# EAGLE design Battery board V4.0 (EAGLE 7.6.0)
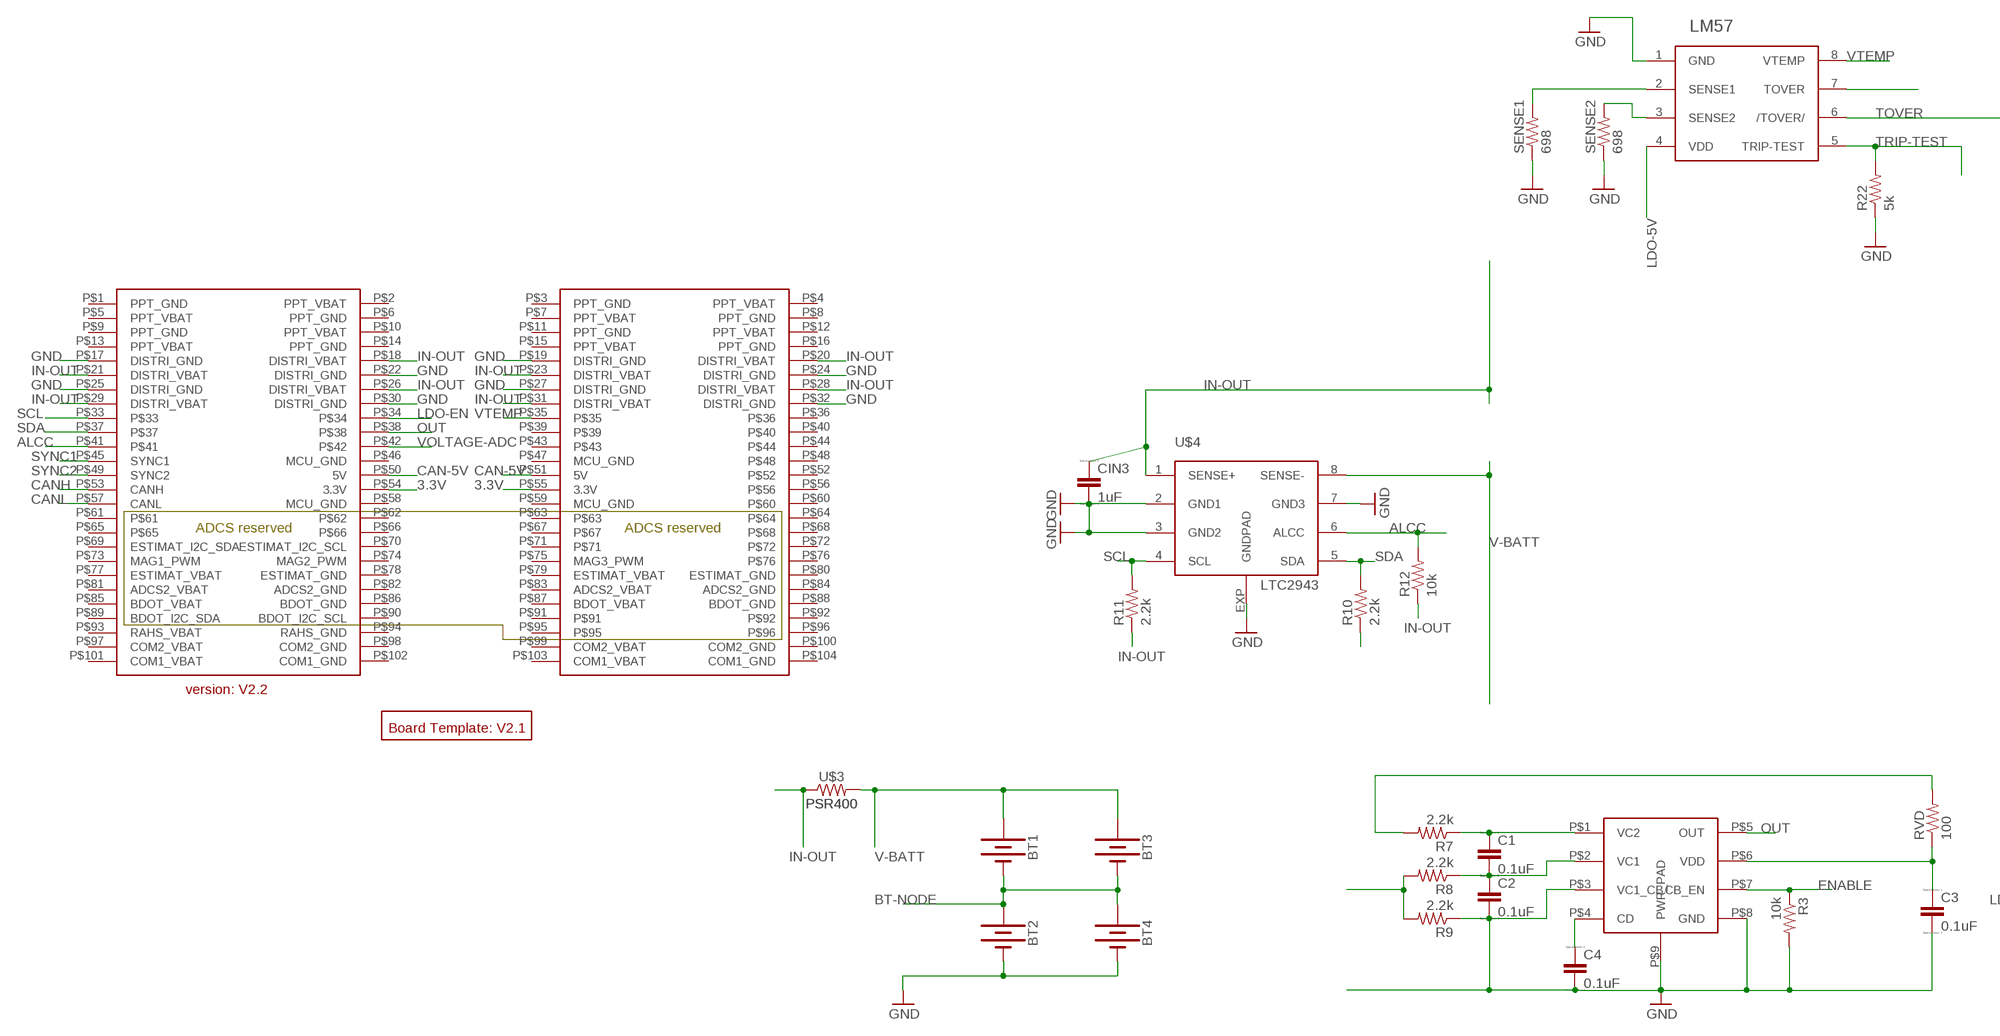
[diagram p0: schematic, sheet 1, part 1 of 2]
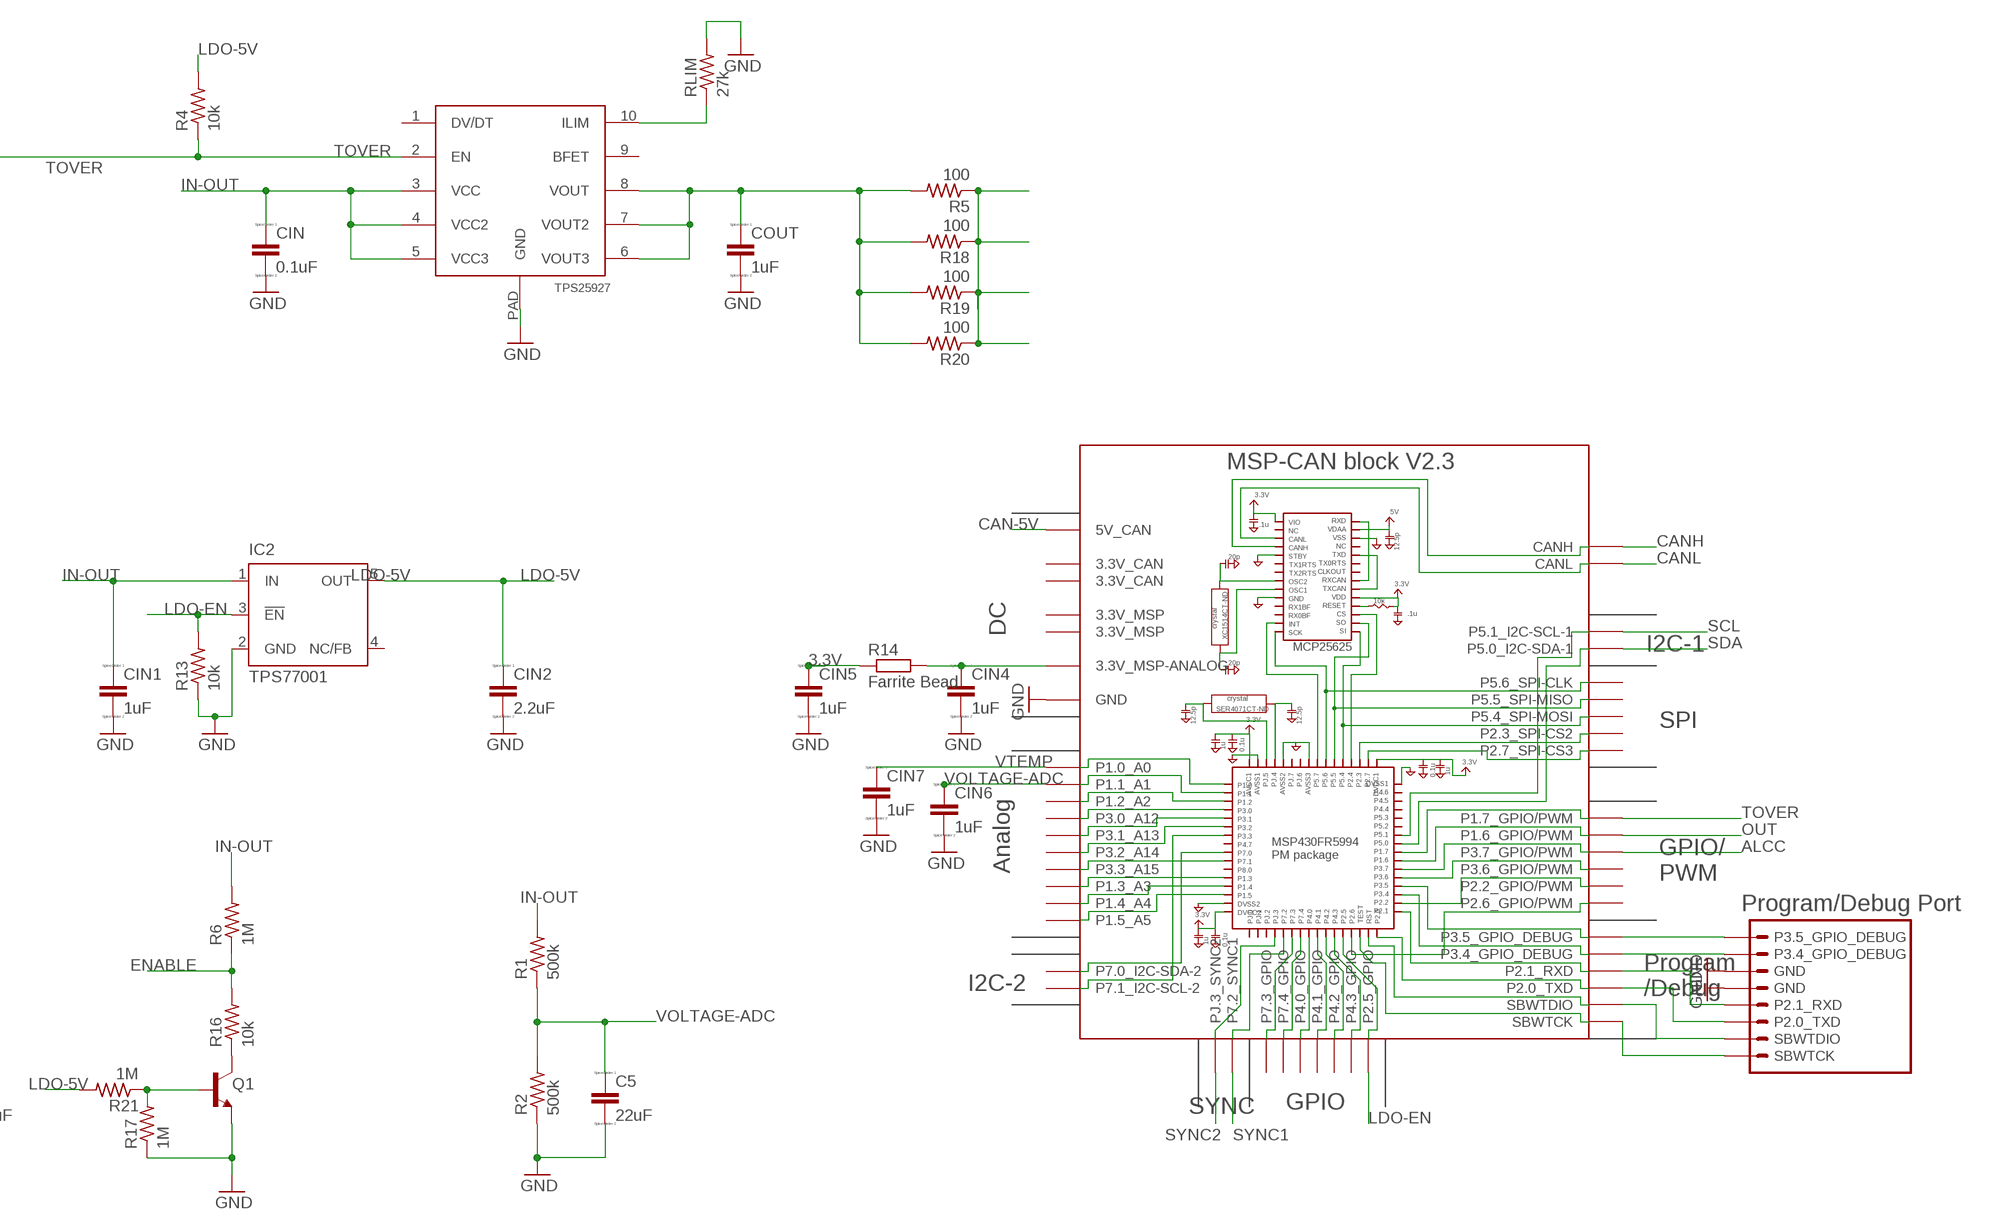
[diagram p1: schematic, sheet 1, part 2 of 2]

## Parts
BT1  BATTERY-18650  [BATTERY_18650-HOLDER]
BT2  BATTERY-18650  [BATTERY_18650-HOLDER]
BT3  BATTERY-18650  [BATTERY_18650-HOLDER]
BT4  BATTERY-18650  [BATTERY_18650-HOLDER]
C1  0.1uF  C  [C0805]
C2  0.1uF  C  [C0805]
C3  0.1uF  C  [C0805]
C4  0.1uF  C  [C0805]
C5  22uF  CC1206  [C1206]
CIN  0.1uF  C  [C0805]
CIN1  1uF  C  [C0805]
CIN2  2.2uF  C  [C0805]
CIN3  1uF  C  [C0805]
CIN4  1uF  C  [C0805]
CIN5  1uF  C  [C0805]
CIN6  1uF  C  [C0805]
CIN7  1uF  C  [C0805]
COUT  1uF  C  [C0805]
IC2  TPS77001  [SOT23-DBV]
Q1  TRANS_NPN-MMBT2222AL  [SOT23-3]
R1  500k  R-US_R0805  [R0805]
R2  500k  R-US_R0805  [R0805]
R3  10k  R-US_R0805  [R0805]
R4  10k  R-US_R0805  [R0805]
R5  100  R-US_R0805  [R0805]
R6  1M  R-US_R0805  [R0805]
R7  2.2k  R-US_R0805  [R0805]
R8  2.2k  R-US_R0805  [R0805]
R9  2.2k  R-US_R0805  [R0805]
R10  2.2k  R-US_R0805  [R0805]
R11  2.2k  R-US_R0805  [R0805]
R12  10k  R-US_R0805  [R0805]
R13  10k  R-US_R0805  [R0805]
R14  Farrite Bead  R-EU_R1206  [R1206]
R16  10k  R-US_R0805  [R0805]
R17  1M  R-US_M0805  [M0805]
R18  100  R-US_R0805  [R0805]
R19  100  R-US_R0805  [R0805]
R20  100  R-US_R0805  [R0805]
R21  1M  R-US_M0805  [M0805]
R22  5k  R-US_R0805  [R0805]
RLIM  27k  R-US_R0805  [R0805]
RVD  100  R-US_R0805  [R0805]
SENSE1  698  R-US_R0805  [R0805]
SENSE2  698  R-US_R0805  [R0805]
U$1  MSP-CAN_BLOCK  [MSP-CAN_BLOCK]
U$2  PROGRAM/DEBUG_PORT  [1X08_CONNECTOR]
U$3  PSR400  [PSR400]
U$4  LTC2943  [DFN8(3X3)LT]
U$5  TPS252927  [VSON10]
U$6  LM57  [TSSOP-8]
U$7  2X26_CONNECTOR_(V2.2)  [4X26_CONNECTOR_(V2.2)]
U$8  BQ29209  [VSON8]
U$9  BOARD_TEMPLATE_(V2.1)  [BOARD_TEMPLATE_(V2.1)]

## Nets
3.3V: CIN5.1 R14.1 U$7.P$54(3.3V) U$7.P$55(3.3V)
ALCC: R12.2 U$1.P3.7_GPIO/PWM U$4.6(ALCC) U$7.P$41
BASE: Q1.1(B) R17.2 R21.1
BT-NODE: BT1.GND@1(-) BT2.PWR@1(+) BT3.GND@1(-) BT4.PWR@1(+) R8.2 R9.2
CAN-5V: U$1.5V(5V_CAN) U$7.P$50(5V) U$7.P$51(5V)
CANH: U$1.CANH U$7.P$53(CANH)
CANL: U$1.CANL U$7.P$57(CANL)
ENABLE: R3.1 R6.1 R16.2 U$8.P$7(CB_EN)
FERRITE-BEAD: CIN4.1 R14.2 U$1.3.3V_ANALOG@MSP2(3.3V_MSP-ANALOG)
GND: BT2.GND@1(-) BT4.GND@1(-) C2.2 C3.2 C4.2 C5.2 CIN1.2 CIN2.2 CIN3.2 CIN4.2 CIN5.2 CIN6.2 CIN7.2 CIN.2 COUT.2 IC2.2(GND) Q1.2(E) R2.1 R3.2 R9.1 R13.1 R17.1 R22.1 RLIM.2 SENSE1.1 SENSE2.1 U$1.GND@1(GND) U$1.GND@2(GND) U$1.GND@3(GND) U$1.GND@4(GND) U$1.GND@5(GND) U$1.GND@7(GND) U$1.GND@8(GND) U$1.GND@9(GND) U$1.GND@10(GND) U$1.GND@11(GND) U$1.GND@12(GND) U$1.GND@13(GND) U$1.GND@14(GND) U$1.GND@15(GND) U$1.GND@16(GND) U$1.GND@17(GND) U$1.GND@26(GND) U$2.5(GND) U$2.6(GND) U$4.2(GND1) U$4.3(GND2) U$4.7(GND3) U$4.EXP(GNDPAD) U$5.PAD(GND) U$6.1(GND) U$7.P$17(DISTRI_GND) U$7.P$19(DISTRI_GND) U$7.P$22(DISTRI_GND) U$7.P$24(DISTRI_GND) U$7.P$25(DISTRI_GND) U$7.P$27(DISTRI_GND) U$7.P$30(DISTRI_GND) U$7.P$32(DISTRI_GND) U$8.P$3(VC1_CB) U$8.P$8(GND) U$8.P$9(PWR_PAD)
HEATER1: R5.1 R18.1 R19.1 R20.1
IN-OUT: CIN1.1 CIN3.1 CIN.1 IC2.1(IN) R1.2 R6.2 R10.1 R11.1 R12.1 U$3.P$1 U$4.1(SENSE+) U$5.3(VCC) U$5.4(VCC2) U$5.5(VCC3) U$7.P$18(DISTRI_VBAT) U$7.P$20(DISTRI_VBAT) U$7.P$21(DISTRI_VBAT) U$7.P$23(DISTRI_VBAT) U$7.P$26(DISTRI_VBAT) U$7.P$28(DISTRI_VBAT) U$7.P$29(DISTRI_VBAT) U$7.P$31(DISTRI_VBAT)
LDO-5V: CIN2.1 IC2.5(OUT) R4.2 R21.2 U$6.4(VDD)
LDO-EN: IC2.3(!EN) R13.2 U$1.P2.5_GPIO U$7.P$34
N$4: C1.1 R7.1 U$8.P$1(VC2)
N$5: C1.2 C2.1 R8.1 U$8.P$2(VC1)
N$6: C3.1 RVD.1 U$8.P$6(VDD)
N$7: Q1.3(C) R16.1
N$8: C4.1 U$8.P$4(CD)
N$9: COUT.1 R5.2 R18.2 R19.2 R20.2 U$5.6(VOUT3) U$5.7(VOUT2) U$5.8(VOUT)
N$10: RLIM.1 U$5.10(ILIM)
N$11: SENSE1.2 U$6.2(SENSE1)
N$12: SENSE2.2 U$6.3(SENSE2)
N$13: U$6.7(TOVER)
N$14: U$1.P3.5_GPIO_DEBUG U$2.8(P3.5_GPIO_DEBUG)
N$15: U$1.P3.4_GPIO_DEBUG U$2.7(P3.4_GPIO_DEBUG)
N$19: U$1.P2.1_RXD U$2.4(P2.1_RXD)
N$20: U$1.P2.0_TXD U$2.3(P2.0_TXD)
N$21: U$1.SBWTDIO U$2.2(SBWTDIO)
N$22: U$1.SBWTCK U$2.SBWTCK
OUT: U$1.P1.6_GPIO/PWM U$7.P$38 U$8.P$5(OUT)
SCL: R11.2 U$1.P5.1_I2C-SCL-1 U$4.4(SCL) U$7.P$33
SDA: R10.2 U$1.P5.0_I2C-SDA-1 U$4.5(SDA) U$7.P$37
SYNC1: U$1.P7.2_SYNC1 U$7.P$45(SYNC1)
SYNC2: U$1.PJ.3_SYNC2 U$7.P$49(SYNC2)
TOVER: R4.1 U$1.P1.7_GPIO/PWM U$5.2(EN) U$6.6(/TOVER/)
TRIP-TEST: R22.2 U$6.5(TRIP-TEST)
V-BATT: BT1.PWR@1(+) BT3.PWR@1(+) R7.2 RVD.2 U$3.P$2 U$4.8(SENSE-)
VOLTAGE-ADC: C5.1 CIN6.1 R1.1 R2.2 U$1.P1.1_A1 U$7.P$42
VTEMP: CIN7.1 U$1.P1.0_A0 U$6.8(VTEMP) U$7.P$35
Unconnected: IC2.4(NC/FB) U$1.3.3V@CAN1(3.3V_CAN) U$1.3.3V@CAN2(3.3V_CAN) U$1.3.3V@MSP1(3.3V_MSP) U$1.3.3V@MSP2(3.3V_MSP) U$1.P1.2_A2 U$1.P1.3_A3 U$1.P1.4_A4 U$1.P1.5_A5 U$1.P2.2_GPIO/PWM U$1.P2.4_SPI-CS2(P2.3_SPI-CS2) U$1.P2.6_GPIO/PWM U$1.P2.7_SPI-CS3 U$1.P3.0_A12 U$1.P3.1_A13 U$1.P3.2_A14 U$1.P3.3_A15 U$1.P3.6_GPIO/PWM U$1.P4.0_GPIO U$1.P4.1_GPIO U$1.P4.2_GPIO U$1.P4.3_GPIO U$1.P5.4_SPI-MOSI U$1.P5.5_SPI-MISO U$1.P5.6_SPI-CLK U$1.P7.0_I2C-SDA-2 U$1.P7.1_I2C-SCL-2 U$1.P7.3_GPIO U$1.P7.4_GPIO U$5.1(DV/DT) U$5.9(BFET) U$7.P$1(PPT_GND) U$7.P$2(PPT_VBAT) U$7.P$3(PPT_GND) U$7.P$4(PPT_VBAT) U$7.P$5(PPT_VBAT) U$7.P$6(PPT_GND) U$7.P$7(PPT_VBAT) U$7.P$8(PPT_GND) U$7.P$9(PPT_GND) U$7.P$10(PPT_VBAT) U$7.P$11(PPT_GND) U$7.P$12(PPT_VBAT) U$7.P$13(PPT_VBAT) U$7.P$14(PPT_GND) U$7.P$15(PPT_VBAT) U$7.P$16(PPT_GND) U$7.P$36 U$7.P$39 U$7.P$40 U$7.P$43 U$7.P$44 U$7.P$46(MCU_GND) U$7.P$47(MCU_GND) U$7.P$48 U$7.P$52 U$7.P$56 U$7.P$58(MCU_GND) U$7.P$59(MCU_GND) U$7.P$60 U$7.P$61 U$7.P$62 U$7.P$63 U$7.P$64 U$7.P$65 U$7.P$66 U$7.P$67 U$7.P$68 U$7.P$69(ESTIMAT_I2C_SDA) U$7.P$70(ESTIMAT_I2C_SCL) U$7.P$71 U$7.P$72 U$7.P$73(MAG1_PWM) U$7.P$74(MAG2_PWM) U$7.P$75(MAG3_PWM) U$7.P$76 U$7.P$77(ESTIMAT_VBAT) U$7.P$78(ESTIMAT_GND) U$7.P$79(ESTIMAT_VBAT) U$7.P$80(ESTIMAT_GND) U$7.P$81(ADCS2_VBAT) U$7.P$82(ADCS2_GND) U$7.P$83(ADCS2_VBAT) U$7.P$84(ADCS2_GND) U$7.P$85(BDOT_VBAT) U$7.P$86(BDOT_GND) U$7.P$87(BDOT_VBAT) U$7.P$88(BDOT_GND) U$7.P$89(BDOT_I2C_SDA) U$7.P$90(BDOT_I2C_SCL) U$7.P$91 U$7.P$92 U$7.P$93(RAHS_VBAT) U$7.P$94(RAHS_GND) U$7.P$95 U$7.P$96 U$7.P$97(COM2_VBAT) U$7.P$98(COM2_GND) U$7.P$99(COM2_VBAT) U$7.P$100(COM2_GND) U$7.P$101(COM1_VBAT) U$7.P$102(COM1_GND) U$7.P$103(COM1_VBAT) U$7.P$104(COM1_GND)

## Library data of the parts
BT1-BT4 = SparkFun-Batteries:BATTERY: Battery - Single Cell A variety of battery chemistries, sizes, and footprints. Device List: 20MM_PTH - Coin Cell Battery Holder - 20mm (PTH) <https://www.sparkfun.com/products/783> 12MM_SMD - Coin Cell Battery Holder - 12mm (SMD) <https://www.sparkfun.com/products/10592> 12MM_PTH - Coin Cell Battery Holder - 12mm (PTH) <https://www.sparkfun.com/products/7948> 20MM_SMD - 20mm Coin Cell Battery Holder (SMD) (2 legs) Used on the Big Time Watch Kit <https://www.sparkfun.com/products/11734> 20MM_SMD_4LEGS - Coin Cell Battery Holder - 20mm (SMD) <https://www.sparkfun.com/products/11892> 20MM_SMD_4LEGS_OVERPASTE - Coin Cell Battery Holder - 20mm (SMD) <https://www.sparkfun.com/products/11892> (Over-paste on the legs) 24.5MM_PTH - Coin Cell Battery Holder - 24.5mm (PTH) <https://www.sparkfun.com/products/8863> 9V - 9V Battery Holder - PC Mount Used on the SparkFun SparkPunk Sound Kit <https://www.sparkfun.com/products/11177> and SparkFun SparkPunk Sequencer Kit <https://www.sparkfun.com/products/12707> 18650 - Battery Holder - 18650 (PTH) <https://www.sparkfun.com/products/13113> AA - Battery Holder - 1xAA (PTH) <https://www.sparkfun.com/products/7949> AAA - Battery Holder - 1xAAA (PTH) <https://www.sparkfun.com/products/12718> AA_KIT - Battery Holder - 1xAA (PTH) <https://www.sparkfun.com/products/7949> Special kit package - pads only have exposed copper on one side of the board. AAA_KIT - Battery Holder - 1xAAA (PTH) <https://www.sparkfun.com/products/12718> Special kit package - pads only have exposed copper on one side of the board.; PROD_ID: BATT-12327; SF_SKU: PRT-13113
C1-C5 CIN CIN1-CIN7 COUT = eagle-ltspice:C: CAPACITOR, European symbol; SPICEMODEL: NONE; SPICEPREFIX: C
IC2 = texas:TPS770*: ULTRALOW-POWER 50-mA LOW-DROPOUT LINEAR REGULATORS 50-mA Low-Dropout Regulator Source: http://focus.ti.com/lit/ds/symlink/tps77001.pdf; MF: TEXAS INSTRUMENTS; MPN: TPS77001DBVT; OC_FARNELL: 8461554; OC_NEWARK: 77C1171
Q1 = SparkFun-DiscreteSemi:TRANS_NPN: NPN transistor Current controlled devices typically used to amplify current or used as a switch. BC547 - COM-08928 <http://www.sparkfun.com/products/8928> (TO-92 45V 100mA) (1.Collector 2.Base 3.Emitter) 2N3904 - COM-00521 <http://www.sparkfun.com/products/521> (TO-92 40V 200mA) (1.Emitter 2.Base 3.Collector) P2N2222A - COM-12852 <http://www.sparkfun.com/products/12852> (TO-92 40V 600mA) (1.Collector 2.Base 3.Emitter); PROD_ID: TRANS-08049; VALUE: 600mA/40V
R1-R13 R16-R22 RLIM RVD SENSE1 SENSE2 = rcl:R-US_: RESISTOR, American symbol
R14 = rcl:R-EU_: RESISTOR, European symbol
U$1 = CubeSat(V2.2) (2):MSP-CAN_BLOCK
U$2 = CubeSat(V2.2) (2):PROGRAM/DEBUG_PORT
U$3 = Parts for Power Team1:PSR400
U$4 = Parts for Power Team1:LTC2943
U$5 = Parts for Power Team1:TPS252927: http://www.ti.com/product/tps25927/datasheet
U$6 = Parts for Power Team:LM57
U$7 = CubeSat(V2.2) (2):2X26_CONNECTOR_(V2.2)
U$8 = Parts for Power Team1:BQ29209
U$9 = CubeSat(V2.2) (2):BOARD_TEMPLATE_(V2.1)

## Board
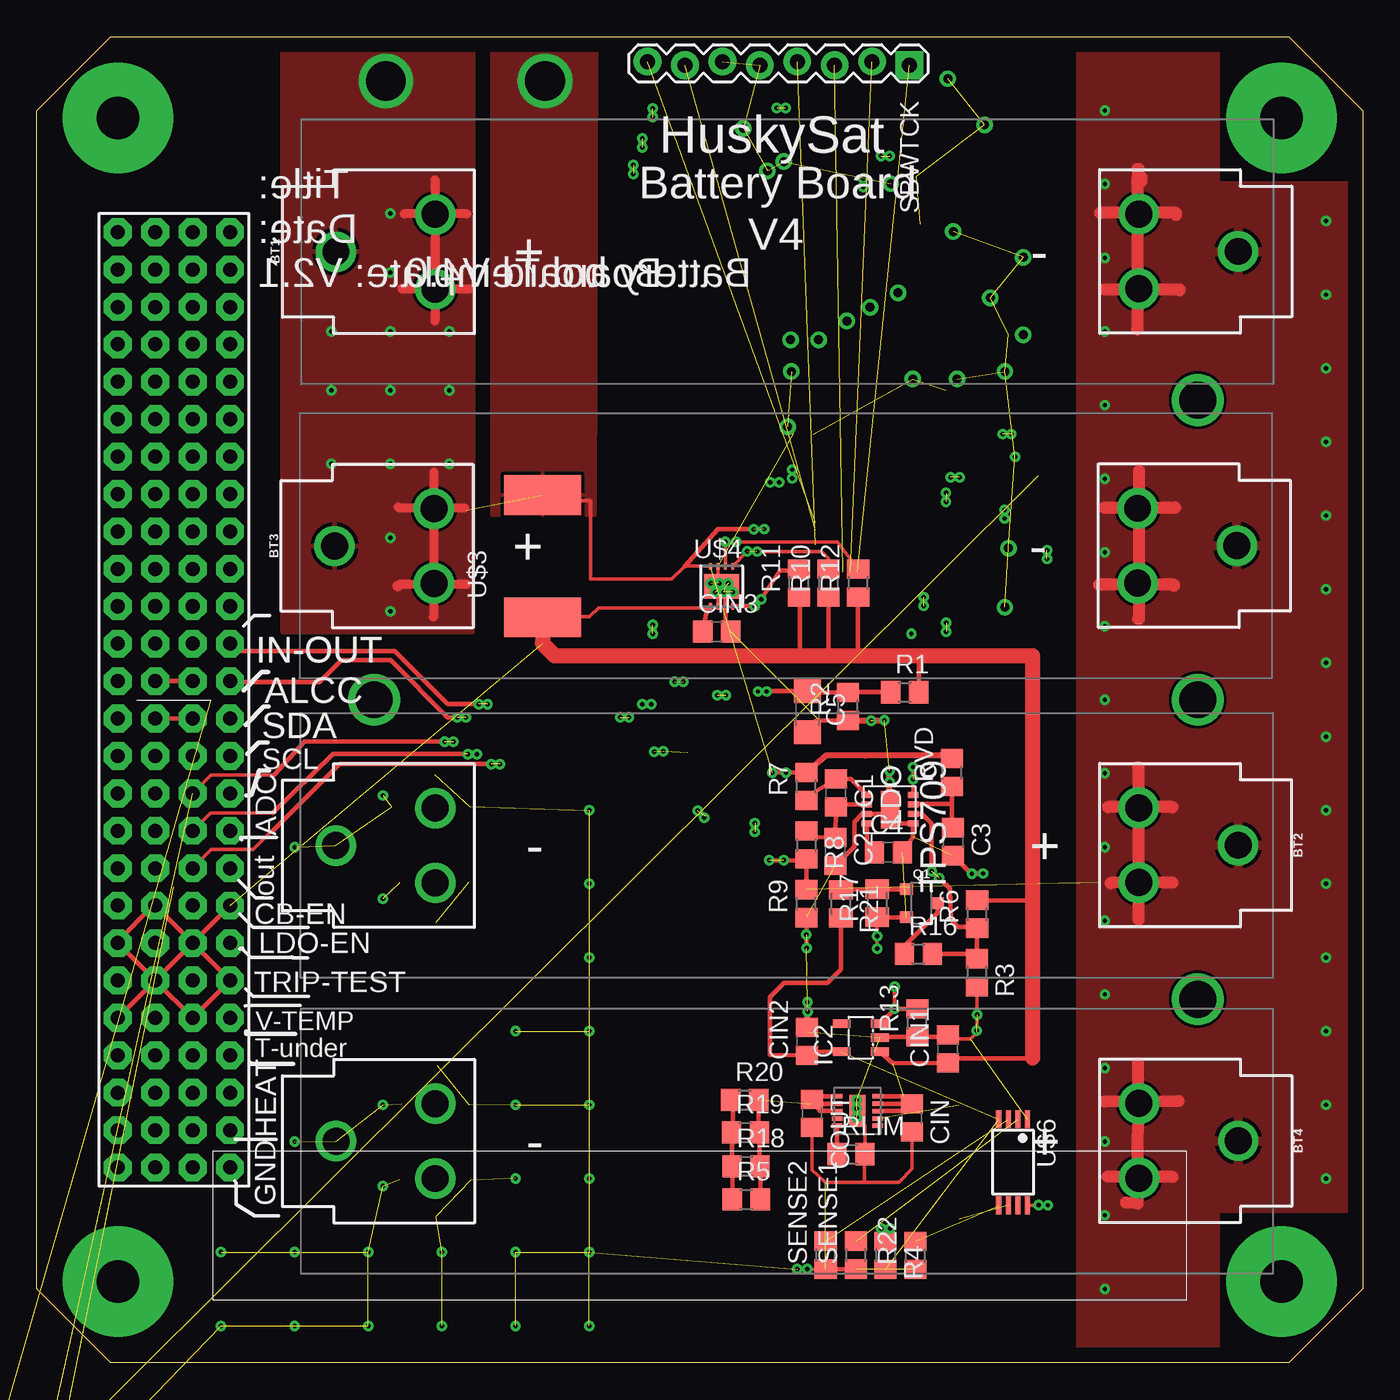
[diagram p2: board, top side]
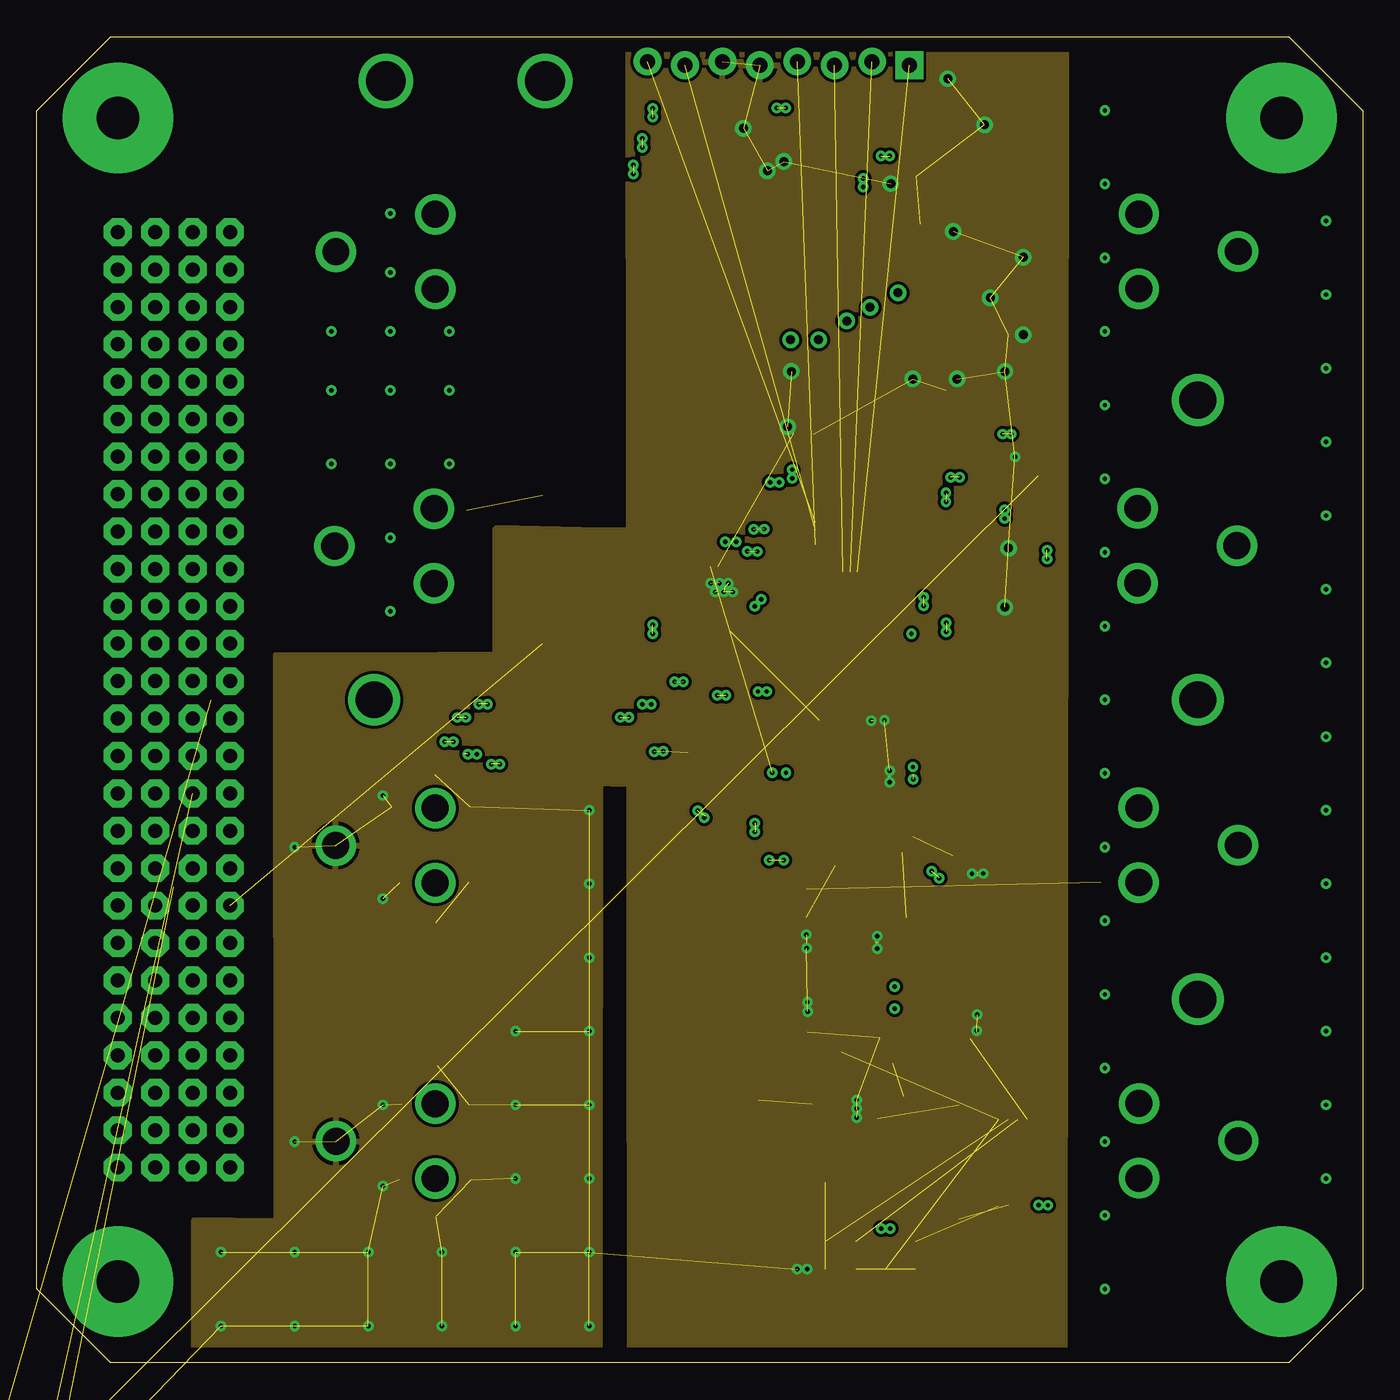
[diagram p3: board, inner layer Route2]
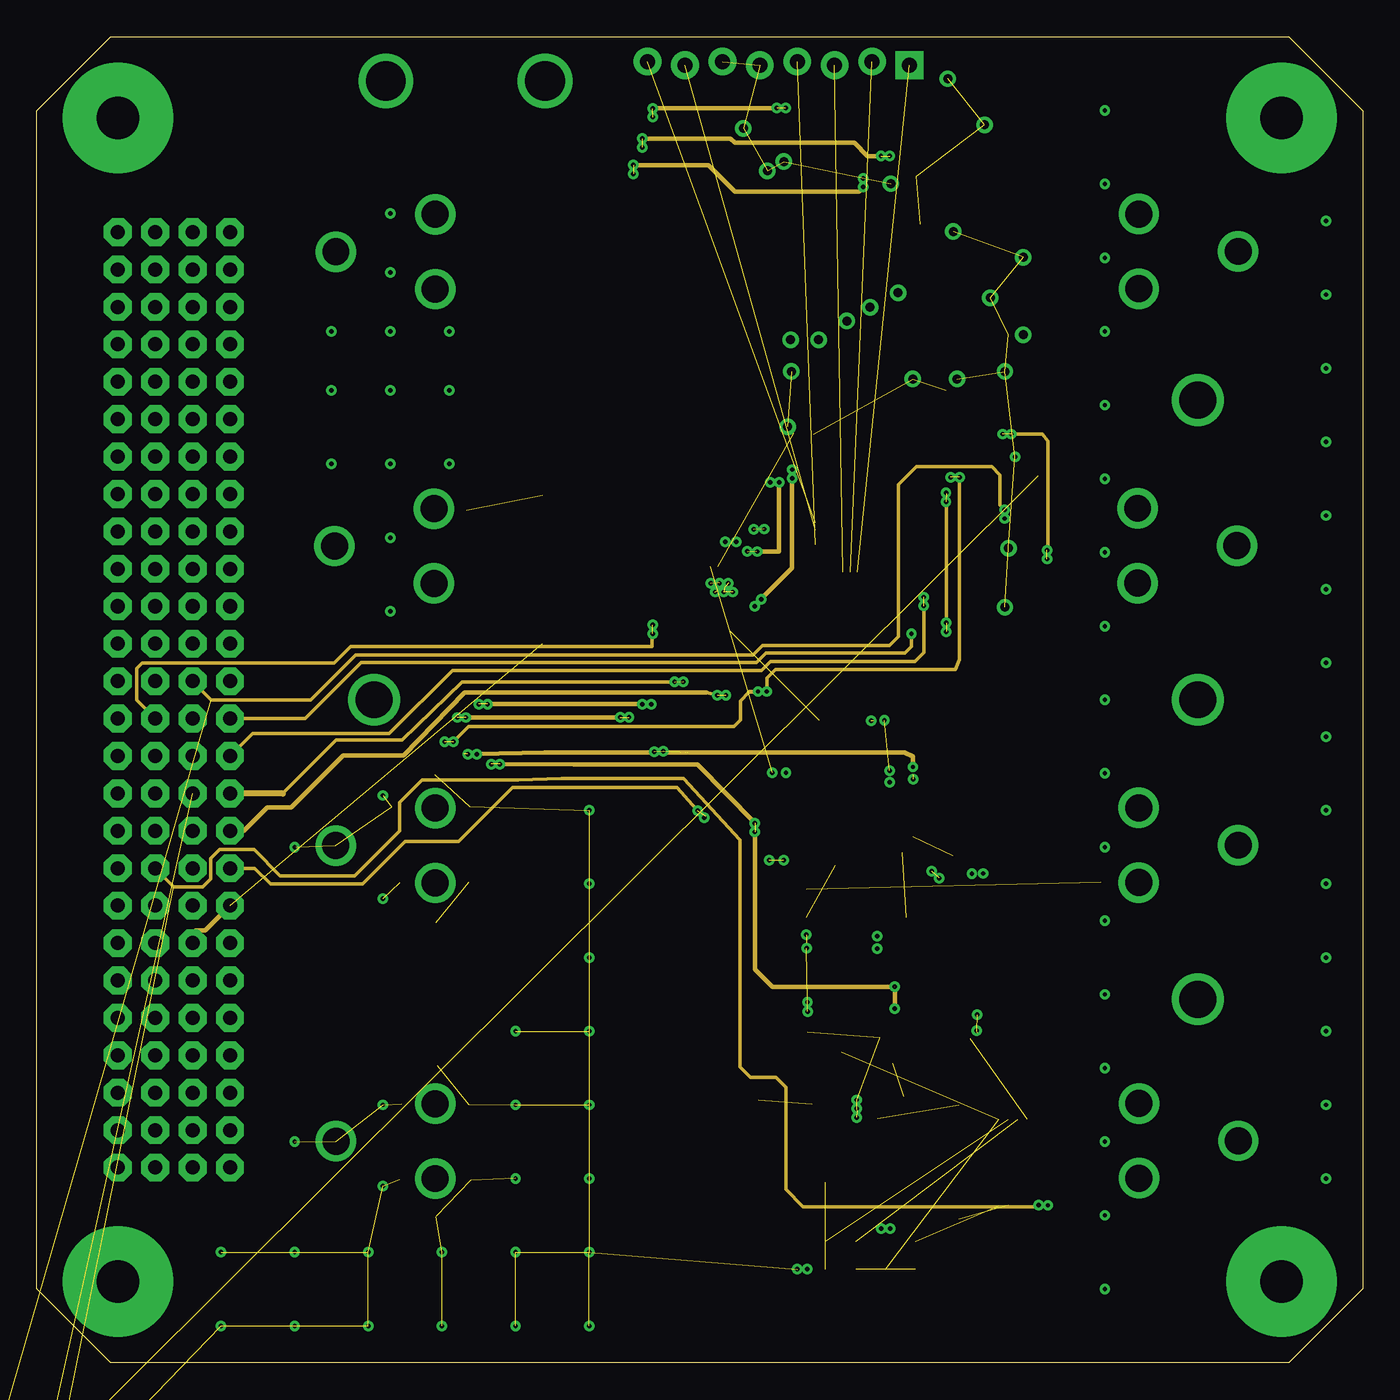
[diagram p4: board, inner layer Route15]
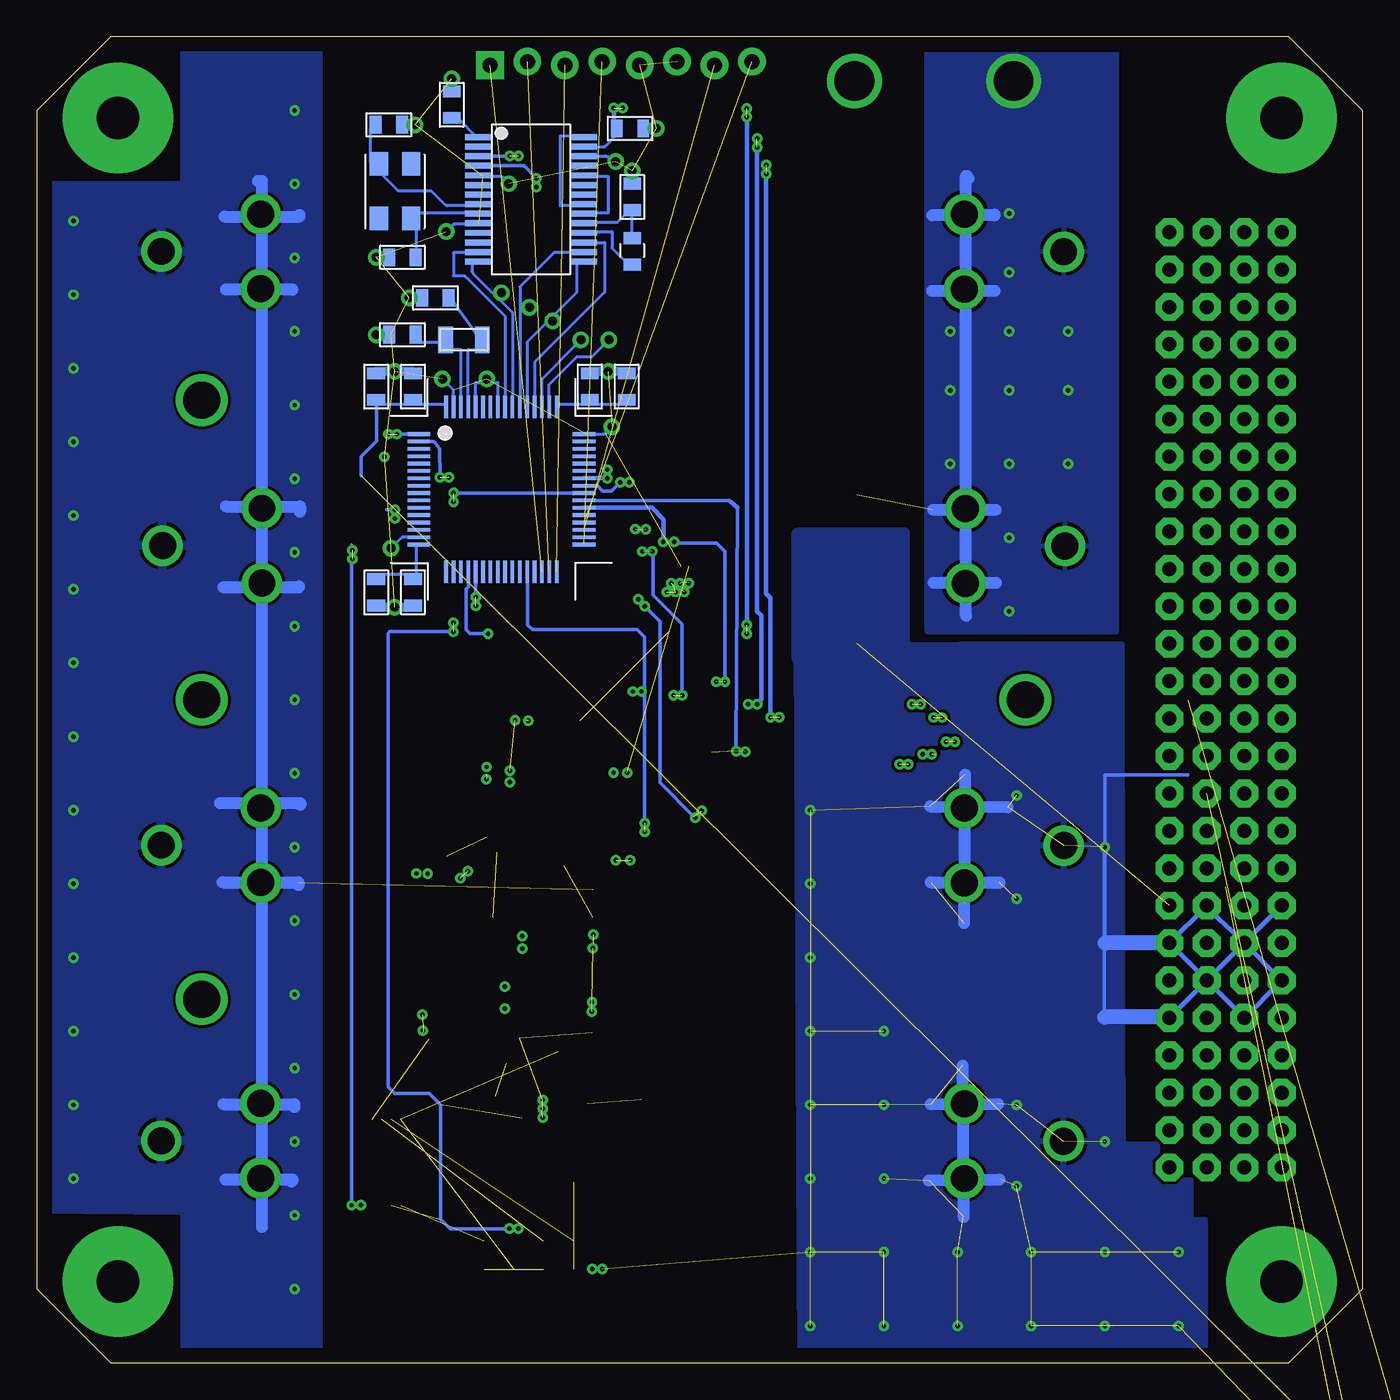
[diagram p5: board, bottom side, seen from below]

Size 90 x 90 mm. Coordinates in mm from the lower left corner, seen from the top.
Copper layers (1*2*15*16): Top 0.035mm / dielectric 0.5mm / Route2 0.035mm / dielectric 0.5mm / Route15 0.035mm / dielectric 0.5mm / Bottom 0.035mm
Design rules "default *": minimum track width 10mil, minimum drill 24mil, track to track 8mil, track to pad 8mil, pad to pad 8mil, via to via 8mil, smd to smd 8mil, copper to edge 40mil, drill to drill 8mil, minimum pad ring 10mil, minimum via ring 8mil, stop-mask expansion 4mil, vias tented up to drill 0mil, thermal gap 10mil

### Footprints (pad centres in the part's own frame; a part is rotated, then mirrored left to right if it is on the bottom)
BATTERY_18650-HOLDER = drill 1.829: GND@1 30.628,0.01; GND@2 23.88,2.55; GND@3 23.88,-2.53; PWR@1 -30.628,-0.01; PWR@2 -23.88,2.53; PWR@3 -23.88,-2.55
C0805 = smd 1.3 x 1.5: 1 -0.95,0; 2 0.95,0
C1206 = smd 1.6 x 1.8: 1 -1.4,0; 2 1.4,0
SOT23-DBV = smd 0.55 x 1.2: 1 -0.95,-1.3; 2 0,-1.3; 3 0.95,-1.3; 4 0.95,1.3; 5 -0.95,1.3
SOT23-3 = smd 0.8 x 0.9: 1 -0.95,-1; 2 0.95,-1; 3 0,1.1
R0805 = smd 1.3 x 1.5: 1 -0.95,0; 2 0.95,0
R1206 = smd 1.6 x 1.803: 1 -1.422,0; 2 1.422,0
M0805 = smd 1.3 x 1.6: 1 -0.95,0; 2 0.95,0
MSP-CAN_BLOCK = smd 1.2 x 0.8: 1 -6,6.08; 2 -6,7.88; 3 -8.5,6.08; 4 -8.5,7.88; 9 -8.5,-6.08; 10 -8.5,-7.88; 11 -6,-6.08; 12 -6,-7.88; 13 8.5,6.08; 14 8.5,7.88; 15 6,6.08; 16 6,7.88; 23 8.875,18.955; 24 8.875,20.755; 25 8.875,17.045; 26 8.875,15.245; 27 -3.375,25.205; 28 -3.375,27.005 | smd 1 x 0.25: 3.3V@CAN1 -3.375,25.125; 3.3V@CAN2 8.875,18.875; 3.3V@MSP1 8.501,5.884; 3.3V@MSP2 -8.533,-5.962; 3.3V_ANALOG@MSP2 -8.482,5.904 | smd 0.8 x 1.2: 5 -5.83,10.5; 6 -7.63,10.5; 7 -3.58,13; 8 -5.38,13; 17 -8.545,24.75; 18 -6.745,24.75; 19 -5.83,15.75; 20 -7.63,15.75; 21 7.83,24.5; 22 9.63,24.5 | smd 0.25 x 1: 5V 7.65,24.5 | smd 1.75 x 0.4: CANH -1.6,21.96; CANL -1.6,22.61; P$65 -1.6,23.91; P$66 -1.6,23.26; P$69 -1.6,21.31; P$70 -1.6,20.66; P$71 -1.6,20.01; P$72 -1.6,19.36; P$73 -1.6,18.71; P$74 -1.6,18.06; P$75 -1.6,17.41; P$76 -1.6,16.76; P$77 -1.6,16.11; P$78 -1.6,15.46; P$79 5.6,15.46; P$80 5.6,16.11; P$81 5.6,16.76; P$82 5.6,17.41; P$83 5.6,18.06; P$84 5.6,18.71; P$85 5.6,19.36; P$86 5.6,20.01; P$87 5.6,20.66; P$88 5.6,21.31; P$89 5.6,21.96; P$90 5.6,22.61; P$91 5.6,23.26; P$92 5.6,23.91 | drill 0.61: GND@1 -3.375,27.875; GND@2 -5.875,24.75; GND@3 -3.75,17.5; GND@4 0.5,20.75; GND@5 -8.5,15.75; GND@7 -8.5,10.5; GND@8 -7.25,8; GND@9 -4,7.5; GND@10 -1,7.5; GND@11 7.75,22.25; GND@12 10.5,24.5; GND@13 8.875,21.625; GND@14 7.25,8; GND@15 7.5,4.25; GND@16 -7.5,-4; GND@17 -7.25,-8; GND@26 -6.25,13; P2.4_SPI-CS2 5.397,10.16; P2.7_SPI-CS3 7.303,10.16; P5.4_SPI-MOSI 3.487,11.434; P5.5_SPI-MISO 1.9,12.354; P5.6_SPI-CLK 0,13.348 | smd 1.55 x 0.25: P1.0_A0 -5.6,3.75; P1.1_A1 -5.6,3.25; P1.2_A2 -5.6,2.75; P1.3_A3 -5.6,-1.75; P1.4_A4 -5.6,-2.25; P1.5_A5 -5.6,-2.75; P1.6_GPIO/PWM 5.6,-0.75; P1.7_GPIO/PWM 5.6,-0.25; P2.1_RXD 5.6,-3.75; P2.2_GPIO/PWM 5.6,-3.25; P3.0_A12 -5.6,2.25; P3.1_A13 -5.6,1.75; P3.2_A14 -5.6,1.25; P3.3_A15 -5.6,0.75; P3.4_GPIO_DEBUG 5.6,-2.75; P3.5_GPIO_DEBUG 5.6,-2.25; P3.6_GPIO/PWM 5.6,-1.75; P3.7_GPIO/PWM 5.6,-1.25; P5.0_I2C-SDA-1 5.6,0.25; P5.1_I2C-SCL-1 5.6,0.75; P7.0_I2C-SDA-2 -5.6,-0.25; P7.1_I2C-SCL-2 -5.6,-0.75; P$8 -5.6,0.25; P$11 -5.6,-1.25; P$15 -5.6,-3.25; P$16 -5.6,-3.75; P$43 5.6,1.25; P$44 5.6,1.75; P$45 5.6,2.25; P$46 5.6,2.75; P$47 5.6,3.25; P$48 5.6,3.75 | smd 0.25 x 1.55: P2.0_TXD 3.75,-5.6; P2.5_GPIO 1.75,-5.6; P2.6_GPIO/PWM 2.25,-5.6; P4.0_GPIO -0.25,-5.6; P4.1_GPIO 0.25,-5.6; P4.2_GPIO 0.75,-5.6; P4.3_GPIO 1.25,-5.6; P7.2_SYNC1 -1.75,-5.6; P7.3_GPIO -1.25,-5.6; P7.4_GPIO -0.75,-5.6; P$17 -3.75,-5.6; P$18 -3.25,-5.6; P$19 -2.75,-5.6; P$49 3.75,5.6; P$50 3.25,5.6; P$51 2.75,5.6; P$52 2.25,5.6; P$53 1.75,5.6; P$54 1.25,5.6; P$55 0.75,5.6; P$56 0.25,5.6; P$57 -0.25,5.6; P$58 -0.75,5.6; P$59 -1.25,5.6; P$60 -1.75,5.6; P$61 -2.25,5.6; P$62 -2.75,5.6; P$63 -3.25,5.6; P$64 -3.75,5.6; PJ.3_SYNC2 -2.25,-5.6; SBWTCK 2.75,-5.6; SBWTDIO 3.25,-5.6 | smd 1 x 1.8: P$93 -3.79,10.16; P$94 -1.29,10.16 | smd 1.25 x 1.6: P$104 -6.13,18.38; P$105 -6.13,22.08; P$106 -8.33,22.08; P$107 -8.33,18.38
1X08_CONNECTOR = drill 1.016 pad 1.88: 2 2.54,-0.127; 3 5.08,0.127; 4 7.62,-0.127; 5 10.16,0.127; 6 12.7,-0.127; 7 15.24,0.127; 8 17.78,-0.127 | drill 1.016 pad 1.88 square: SBWTCK 0,0.127
PSR400 = smd 2.7 x 5.2: P$1 0,0; P$2 8.3,0
DFN8(3X3)LT = smd 0.25 x 0.45: 1 -2.02,-0.08; 2 -1.52,-0.08; 3 -1.02,-0.08; 4 -0.52,-0.08; 5 -0.52,2.62; 6 -1.02,2.62; 7 -1.52,2.62; 8 -2.02,2.62 | smd 2.38 x 1.65: EXP -1.27,1.27
VSON10 = smd 0.7 x 0.305: 1 0.2,2.575; 2 0.2,2.075; 3 0.2,1.575; 4 0.2,1.075; 5 0.2,0.575; 6 2.95,0.575; 7 2.95,1.075; 8 2.95,1.575; 9 2.95,2.075; 10 2.95,2.575 | smd 1.067 x 2.184: PAD 1.575,1.575
TSSOP-8 = smd 1.2 x 0.35: 1 -4.175,1.725; 2 -4.175,1.075; 3 -4.175,0.425; 4 -4.175,-0.225; 5 1.675,-0.225; 6 1.675,0.425; 7 1.675,1.075; 8 1.675,1.725
4X26_CONNECTOR_(V2.2) = drill 0.953 pad 1.88 octagon: P$1 -31.75,31.88; P$2 -31.75,34.42; P$3 -31.75,36.96; P$4 -31.75,39.5; P$5 -29.21,31.88; P$6 -29.21,34.42; P$7 -29.21,36.96; P$8 -29.21,39.5; P$9 -26.67,31.88; P$10 -26.67,34.42; P$11 -26.67,36.96; P$12 -26.67,39.5; P$13 -24.13,31.88; P$14 -24.13,34.42; P$15 -24.13,36.96; P$16 -24.13,39.5; P$17 -21.59,31.88; P$18 -21.59,34.42; P$19 -21.59,36.96; P$20 -21.59,39.5; P$21 -19.05,31.88; P$22 -19.05,34.42; P$23 -19.05,36.96; P$24 -19.05,39.5; P$25 -16.51,31.88; P$26 -16.51,34.42; P$27 -16.51,36.96; P$28 -16.51,39.5; P$29 -13.97,31.88; P$30 -13.97,34.42; P$31 -13.97,36.96; P$32 -13.97,39.5; P$33 -11.43,31.88; P$34 -11.43,34.42; P$35 -11.43,36.96; P$36 -11.43,39.5; P$37 -8.89,31.88; P$38 -8.89,34.42; P$39 -8.89,36.96; P$40 -8.89,39.5; P$41 -6.35,31.88; P$42 -6.35,34.42; P$43 -6.35,36.96; P$44 -6.35,39.5; P$45 -3.81,31.88; P$46 -3.81,34.42; P$47 -3.81,36.96; P$48 -3.81,39.5; P$49 -1.27,31.88; P$50 -1.27,34.42; P$51 -1.27,36.96; P$52 -1.27,39.5; P$53 1.27,31.88; P$54 1.27,34.42; P$55 1.27,36.96; P$56 1.27,39.5; P$57 3.81,31.88; P$58 3.81,34.42; P$59 3.81,36.96; P$60 3.81,39.5; P$61 6.35,31.88; P$62 6.35,34.42; P$63 6.35,36.96; P$64 6.35,39.5; P$65 8.89,31.88; P$66 8.89,34.42; P$67 8.89,36.96; P$68 8.89,39.5; P$69 11.43,31.88; P$70 11.43,34.42; P$71 11.43,36.96; P$72 11.43,39.5; P$73 13.97,31.88; P$74 13.97,34.42; P$75 13.97,36.96; P$76 13.97,39.5; P$77 16.51,31.88; P$78 16.51,34.42; P$79 16.51,36.96; P$80 16.51,39.5; P$81 19.05,31.88; P$82 19.05,34.42; P$83 19.05,36.96; P$84 19.05,39.5; P$85 21.59,31.88; P$86 21.59,34.42; P$87 21.59,36.96; P$88 21.59,39.5; P$89 24.13,31.88; P$90 24.13,34.42; P$91 24.13,36.96; P$92 24.13,39.5; P$93 26.67,31.88; P$94 26.67,34.42; P$95 26.67,36.96; P$96 26.67,39.5; P$97 29.21,31.88; P$98 29.21,34.42; P$99 29.21,36.96; P$100 29.21,39.5; P$101 31.75,31.88; P$102 31.75,34.42; P$103 31.75,36.96; P$104 31.75,39.5
VSON8 = smd 0.4 x 0.7: P$1 0,0; P$2 0.65,0; P$3 1.3,0; P$4 1.95,0; P$5 0,3.15; P$6 0.65,3.15; P$7 1.3,3.15; P$8 1.95,3.15 | smd 2.54 x 1.27: P$9 1,1.6
BOARD_TEMPLATE_(V2.1) = drill 2.9 pad 7.5: P$1 -39.5,39.5; P$2 -39.5,-39.5; P$3 39.5,-39.5; P$4 39.5,39.5

### Placement (x,y rotation side)
BT1  50.93,75.42 0 top
BT2  50.92,35.12 180 top
BT3  50.84,55.44 0 top
BT4  50.93,15.05 180 top
C1  54.24,38.66 270 top
C2  54.2,34.69 270 top
C3  62.19,35.36 270 top
C4  57.8,34.64 0 top
C5  52.31,44.19 270 top
CIN  59.4,16.61 270 top
CIN1  61.83,21.29 90 top
CIN2  52.27,21.82 90 top
CIN3  46.15,49.62 0 top
CIN4  -2.7,-12.3 0 top  (outside the outline)
CIN5  -2.7,-18.6 0 top  (outside the outline)
CIN6  -2.7,-24.9 0 top  (outside the outline)
CIN7  -2.7,-31.2 0 top  (outside the outline)
COUT  52.62,16.93 270 top
IC2  55.93,22.06 90 top
Q1  60.03,31.19 270 top
R1  58.91,45.51 0 top
R2  55.06,44.54 90 top
R3  63.8,26.47 270 top
R4  57.6,7.3 270 top
R5  48.16,11.09 0 top
R6  63.83,30.44 90 top
R7  52.23,39.12 90 top
R8  52.23,35.14 270 top
R9  52.23,31.16 90 top
R10  53.75,52.92 90 top
R11  51.74,52.93 90 top
R12  55.76,52.93 90 top
R13  59.76,23.06 90 top
R14  -2.1,-8.1 0 top  (outside the outline)
R16  59.83,27.74 0 top
R17  57.03,31.19 90 top
R18  48.15,13.34 0 top
R19  48.1,15.64 0 top
R20  48.05,17.84 0 top
R21  54.58,31.14 270 top
R22  59.63,7.28 90 top
RLIM  55.27,14.16 0 top
RVD  62.12,40.06 90 top
SENSE1  55.6,7.3 90 top
SENSE2  53.55,7.3 90 top
U$1  58.46,59.28 0 bottom
U$2  59.24,88.2 180 top
U$3  34.33,50.59 90 top
U$4  47.75,51.43 0 top
U$5  57.28,18.66 180 top
U$6  65.52,12.36 270 top
U$7  45,44.99 90 top
U$8  56.33,38.54 270 top
U$9  45,45 180 top

### Tracks (layer width: path | path; a pad name or v marks a point on that pad's centre or on a via)
3.3V  (via drill 0.3)  (2 unrouted)
  Top 0.305: U$7.P$55 U$7.P$54
  Route15 0.254: U$7.P$54 11.85,45 18.59,45 21.63,48.04 48.61,48.04 49.27,48.7 57.86,48.7 58.48,49.31 58.48,59.6 59.7,60.82 64.81,60.82 65.39,60.25 65.39,58.21 v65.7,57.9
  Bottom 0.254: 66.26,57.9 v65.7,57.9 v65.7,57.3
ALCC  (via drill 0.3)  (1 unrouted)
  Top 0.254: U$4.6 46.73,54.96 46.73,54.97 v46.74,55.71 46.66,55.72 54.33,55.72 R12.2
  Top 0.305: v47.47,55.71 47.49,55.69 | 47.49,55.69
  Route15 0.254: 16.69,38.64 20.31,42.26 24.78,42.26 28.88,46.22 43.27,46.22 arc90 v43.28,46.23
  Route15 0.406: 16.69,38.64 U$7.P$41
  Bottom 0.254: v43.28,46.23 43.28,55.04 | 43.28,55.04 43.28,55.07 43.86,55.64 46.67,55.64 v46.74,55.71 | 43.28,46.2 43.28,55.04
  Bottom 0.305: U$1.P3.7_GPIO/PWM 48.26,58.03 47.47,57.24 v47.47,55.71 v46.74,55.71 | v46.74,55.71
  other vias: 43.88,46.23
BASE
  Top 0.305: Q1.1 R17.2 54.63,32.14 R21.1
BT-NODE  (via drill 0.3)  (2 unrouted)
  Top 0.305: R9.2 R8.2 52.15,34.11 v49.71,34.11
  Top 0.813: 77.11,12.6 72.68,12.62 | 77.49,17.74 72.48,17.71 | 77.11,32.59 72.88,32.57 | 74.77,40.42 74.78,30.08 | 77.08,37.69 77.08,37.72 72.72,37.72 | 77.21,52.73 77.21,52.81 72.11,52.81 | 77.27,58.07 77.27,58.02 72.48,58.02 | 74.81,60.53 74.81,50.49 74.76,50.49 | 77.35,77.92 77.35,78.05 72.16,78.05 | 77.56,72.79 77.56,72.85 72.48,72.85 | 74.69,80.13 74.69,70.12 74.73,70.12 | 74.74,20.33 74.71,10.81 73.94,10.85 | 74.8,81.02 74.74,81.02 74.74,80.46 74.99,80.46 74.99,80.21
  Bottom 0.813: 74.99,80.21 74.72,80.21 74.72,9.19 | 77.28,77.8 72.17,77.8 72.17,77.91 | 77.17,72.87 72.64,72.87 72.64,72.83 | 77.17,58.13 72.13,58.13 72.13,57.77 | 77.32,52.65 72.2,52.65 72.2,52.69 | 77.57,37.98 72.09,37.98 72.09,37.87 | 77.39,32.61 72.24,32.61 72.24,32.4 | 77.32,17.55 72.53,17.55 72.53,17.33 | 77.21,12.43 72.64,12.43 72.64,12.36 72.71,12.36 72.71,12.29
  other vias: 72.5,35 72.5,40 72.5,30 72.5,25 72.5,20 72.5,15 72.5,10 72.5,5 72.5,45 72.5,50 72.5,55 72.5,60 72.5,65 72.5,70 72.5,75 72.5,80 72.5,85 87.5,67.5 87.5,62.5 87.5,57.5 87.5,52.5 87.5,47.5 87.5,42.5 87.5,37.5 87.5,32.5 87.5,27.5 87.5,22.5 87.5,17.5 87.5,12.5 87.5,72.5 87.5,77.5 50.7,34.11
  pour Top: 90.38,80.1 90.34,10.43 80.01,10.41 80.01,0.17 70.92,0.2 70.92,0.25 70.87,0.25 70.87,89.78 80,89.78 80,79.9 89.03,79.9 89.03,79.85
  pour Bottom: 90.38,80.1 90.34,10.43 79.95,10.35 79.95,0.12 70.92,0.2 70.92,0.25 70.87,0.25 70.87,89.78 80,89.78 80,79.9 89.03,79.9 89.03,79.85
CAN-5V  (via drill 0.3)  (3 unrouted)
  Top 0.305: U$7.P$51 U$7.P$50
  Route15 0.254: U$7.P$51 8.04,43.74 6.79,44.98 6.79,47.13 7.16,47.5 20.17,47.5 21.29,48.61 41.78,48.61 v41.8,50.09
  Route15 0.305: v41.82,85.15 50.81,85.15 v50.83,85.17
  Bottom 0.305: v41.8,50.09 41.8,85.13 v41.82,85.15 | v50.83,85.17 50.83,83.8 U$1.5V
  other vias: 41.82,84.55 50.23,85.17 41.8,49.48
CANH  (via drill 0.3)  (3 unrouted)
  Top 0.305: U$7.P$53 13.18,46.2 19.2,46.2 20.7,47.7 24,47.7 27.9,43.8 v28.53,43.79
  Route15 0.305: v28.53,43.79 v40.2,43.8 | v40.5,81.3 45.6,81.3 47.4,79.5 55.8,79.5 v56.1,79.8 v56.1,80.4
  Bottom 0.254: v56.1,80.4 56.94,81.24 U$1.CANH
  Bottom 0.305: v40.2,43.8 40.2,51.9 40.5,52.2 v40.5,81.3
  other vias: 29.13,43.79 39.6,43.8 40.5,80.7
CANL  (via drill 0.3)  (3 unrouted)
  Top 0.305: U$7.P$57 13.62,48.3 24.3,48.3 27.9,44.7 v30,44.7
  Route15 0.305: v30,44.7 v41.7,44.7 | v41.1,83.1 47.1,83.1 47.4,82.8 55.5,82.8 56.4,81.9 v57.3,81.9
  Bottom 0.254: v57.31,81.89 U$1.CANL
  Bottom 0.305: v41.7,44.7 v41.1,44.7 40.8,45 40.8,50.7 41.1,51 v41.1,83.1 | v57.3,81.9 v57.31,81.89
  other vias: 57.9,81.9 41.1,82.5 30.6,44.7
ENABLE  (via drill 0.3)  (2 unrouted)
  Top 0.305: R16.2 63.48,27.74 R3.1 63.8,29.46 R6.1 63.73,29.59 62.53,29.59 62.04,30.09 61.99,32.19 60.73,33.39 60.73,36.59 60.08,37.24 U$8.P$7
  other vias: 60.75,33.35 61.26,32.89
FERRITE-BEAD  (2 unrouted)
  Bottom 0.254: 67.29,65.16 67.27,65.19 U$1.3.3V_ANALOG@MSP2 66.95,62.55 68,61.5 68,60.22
GND  (via drill 0.3)  (84 unrouted)
  Top 0.254: U$4.2 46.23,52.45 U$4.EXP 46.23,52.95 U$4.7 | R17.1 v57.04,28.95 | v57.04,28.95 v57.04,28.11 | v57.04,28.95 57.06,28.97 | v55.66,16.64 56.22,16.08 RLIM.2 56.18,14.12 56.18,12.24 56.17,12.23 | COUT.2 52.62,13.1 53.52,12.23 56.17,12.23 | R3.2 63.8,22.39 63.39,21.97 61.86,21.97 CIN1.2 | SENSE2.1 51.63,6.35 v51.62,6.37 | v52.28,6.35 52.28,6.39 | CIN.2 59.4,13.15 58.53,12.23 56.17,12.23
  Top 0.305: C4.2 59.48,35.67 U$8.P$8 57.93,36.59 U$8.P$9 57.63,37.24 U$8.P$3 56.01,37.24 55.49,36.71 55.49,35.03 C2.2 | C5.2 arc-90 53.11,43.59 R2.1 | CIN1.2 61.66,22.11 R13.1 57.28,22.11 IC2.2 | Q1.2 R17.1 | SENSE2.1 SENSE1.1 | CIN3.2 46.73,49.62 U$4.3 46.73,52.7 U$4.EXP | R9.1 52.23,28.51 52.23,28.46 52.24,28.2 v52.25,28.13 | C3.2 63.4,33.21 v64.24,33.21 | v63.47,33.19 v63.46,33.2 63.48,33.22 63.48,33.24
  Top 0.406: R2.1 56.77,43.59 56.78,43.6 56.84,43.6 v57.54,43.6 | 57.93,37.86 U$8.P$9 v57.89,40.19 | CIN2.2 52.3,22.43 v52.31,24.49
  Route2 0.254: v57.9,39.4 v57.89,39.4 v57.89,40.19 | v57.04,28.11 57.01,28.14 | 57.01,28.14 | 57.01,28.14 57.04,28.18 v57.04,28.95 | v51.62,6.37 51.64,6.35 v52.28,6.35
  Route2 0.305: v64.24,33.21 v64.25,33.21 64.23,33.19 v63.47,33.19
  Bottom 0.254: 17.5,28.49 v17.5,35 17.5,39.89 17.51,39.9 11.86,39.9 | 17.53,23.46 17.53,35.02 17.6,35.02 17.6,35.05
  Bottom 0.305: U$7.P$22 U$7.P$25 10.66,30.94 | U$7.P$22 13.06,23.46 U$7.P$17 | U$7.P$27 U$7.P$22 | U$7.P$19 8.04,23.34 8.14,23.24 8.14,23.5 U$7.P$22 | U$7.P$24 5.58,26.03 | 5.58,26.03 U$7.P$27 | 5.58,26.03 5.58,25.85 8.09,23.34 | 8.09,23.34 8.09,23.33 | 8.09,23.34 8.09,23.39 8.1,23.4 | 10.66,30.94 U$7.P$30 | U$7.P$32 5.69,31.03 5.73,30.98 5.73,30.79 U$7.P$27 | 10.66,30.94 8.01,28.49 arc221 8.07,28.46
  Bottom 0.61: 27.09,9.9 27.09,9.93 | 27.06,29.84 27.03,29.82
  Bottom 0.813: 27.15,20.18 27.09,9.9 | 29.46,12.37 24.63,12.44 | 29.31,17.54 24.76,17.56 | 27,39.92 27.06,29.84 | 29.37,37.77 24.08,37.71 | 29.31,32.61 24.66,32.59
  Bottom 1.016: U$7.P$25 17.5,28.49 | 13.06,23.46 17.53,23.46
  other vias: 55.66,17.84 55.66,17.24 45.74,52.91 46.34,52.91 46.94,52.91 46.04,52.31 46.64,52.31 47.24,52.31 56.63,43.58 52.24,29.05 52.32,23.83 37.5,17.5 32.5,12.5 37.5,12.5 37.5,7.5 32.5,7.5 32.5,2.5 37.5,2.5 27.5,7.5 27.5,2.5 22.5,7.5 22.5,2.5 17.5,2.5 17.5,7.5 12.5,2.5 12.5,7.5 32.5,17.5 32.5,22.5 37.5,22.5 37.5,27.5 37.5,32.5 37.5,37.5 63.83,23.62 63.78,22.53 23.5,17.5 23.5,31.5 23.5,38.5 17.5,15 23.5,12 66.4,61.5
  pour Route2: 40.24,-0.03 69.8,0.37 69.89,89.83 40.13,89.96
  pour Bottom (rank 2): 16.34,48.75 38.44,48.68 38.18,0.05 10.68,0.25 10.68,9.69 16.3,9.64
  pour Route2: 35.41,56.42 40.44,56.4 40.67,39.36 33.89,39.5 33.97,46.24
  pour Route2 (rank 2): 16.24,48.05 38.24,48.11 38.18,0.05 10.68,0.25 10.68,9.69 16.3,9.64
  pour Bottom: 11.85,9.65 11.85,13.64 12.81,14.59 16.16,14.59 17.21,15.65 18.05,15.65 18.23,15.47 18.23,9.55 17.79,9.11 12.27,9.11 12.23,9.07
  pour Bottom (isolate 0.61): 38.37,47.89 38.37,56.28 31.17,56.32 31.17,47.48 30.57,47.44 30.57,47.13 38.1,47.13
  pour Route2 (isolate 0.61): 38.37,47.89 38.37,56.28 31.3,56.47 31.3,47.63 30.57,47.44 30.57,47.13 38.1,47.13
HEATER1
  Top 0.305: R20.1 47.26,17.68 47.26,14.89 47.15,15 R19.1 47.2,15.59 R18.1 R5.1
IN-OUT  (2 unrouted)
  Top 0.254: 45.61,51.23 38.12,51.23 37.52,50.64 34.37,50.64 U$3.P$1
  Top 0.305: R11.1 51.8,51.92 51.8,48.1 51.69,47.99 | 45.61,51.23 U$4.1 45.49,51.11 CIN3.1 | U$5.5 58.88,18.08 CIN.1 | U$5.3 58.91,17.08 CIN.1 | IC2.1 58.12,20.32 CIN1.1 61.83,20.66 67.6,20.67 | R12.1 55.76,48.07 55.83,47.99 | R1.2 59.86,47.85 60,47.99 | R10.1 53.75,48 53.73,47.99 | R6.2 67.34,31.39 67.6,31.65 | U$5.4 57.1,17.56 CIN.1 | U$7.P$28 U$7.P$23 U$7.P$26 | U$7.P$26 U$7.P$21 U$7.P$18 8.05,25.93 8.05,25.96 U$7.P$20 | U$7.P$26 U$7.P$29 | U$7.P$26 U$7.P$31 7.91,31.03 5.48,28.59
  Top 1.016: U$3.P$1 34.31,50.58 34.31,48.82 35.14,47.99 51.69,47.99 53.73,47.99 55.83,47.99 60,47.99 67.6,47.99 67.6,31.65 67.6,20.67 | 59.41,17.58 CIN.1
  Route15 0.305: U$7.P$29 11.44,29.35 10.79,29.35
LDO-5V  (2 unrouted)
  Top 0.305: IC2.5 52.28,21.12 CIN2.1 49.78,20.88 49.78,21.04 49.78,24.84 50.73,25.79 53.68,25.79 54.58,26.69 R21.2 | 57.45,6.2 R4.2
LDO-EN  (via drill 0.3)  (3 unrouted)
  Top 0.254: IC2.3 58.22,24 v58.22,25.52 | v58.23,24.03 v58.24,24.02 | U$7.P$34 11.84,34.83 14.68,34.83 15.94,36.09 16.01,36.09
  Top 0.305: R13.2 v58.23,24.01 IC2.3 | 16.01,36.09 20.55,40.64 v30.84,40.64 v30.84,40.63
  Route15 0.305: v30.84,40.64 36.43,40.6 44.86,40.6 48.74,36.63 v48.74,36.63 48.74,26.7 49.92,25.52 v58.22,25.52 | v58.23,25.52 58.24,25.5 v58.24,24.02
  Bottom 0.254: v48.74,36.63 48.74,49.25 49.24,49.75 56.35,49.75 56.68,50.09 56.68,53.65 U$1.P2.5_GPIO
  other vias: 48.74,36.03 31.44,40.63
N$2  (via drill 2.5)
  other vias: 22.9,45
N$4
  Top 0.305: R7.1 52.75,38.69 C1.1 55.26,39.61 U$8.P$1
N$5
  Top 0.305: U$8.P$2 55.03,37.89 C1.2 C2.1 52.62,35.7 R8.1
N$6
  Top 0.305: C3.1 62.13,36.31 62.11,37.92 | 62.11,37.92 RVD.1 | U$8.P$6 59.53,37.94 62.11,37.92
N$7
  Top 0.305: Q1.3 61.13,30.54 58.88,28.29 R16.1
N$8
  Top 0.305: U$8.P$4 56.33,35.46 C4.1
N$9  (1 unrouted)
  Top 0.305: R20.2 49,15.64 R19.2 49.05,13.97 49.1,13.97 R18.2 R5.2 | U$5.7 52.62,17.58 COUT.1 | U$5.8 53.11,17.08 COUT.1 | U$5.6 53.12,18.08 COUT.1
  Top 0.406: COUT.1 52.62,18.11
N$10
  Top 0.305: U$5.10 RLIM.1
N$11  (1 unrouted)
N$12  (1 unrouted)
N$14  (1 unrouted)
N$15  (1 unrouted)
N$16  (via drill 2.5)
  other vias: 78.8,45
N$17  (via drill 2.5)
  other vias: 78.8,65.33
N$18  (via drill 2.5)
  other vias: 78.8,24.67
N$19  (1 unrouted)
N$20  (1 unrouted)
N$21  (1 unrouted)
N$22  (1 unrouted)
OUT  (via drill 0.3)  (4 unrouted)
  Top 0.254: U$8.P$5 59.47,39.9 v59.47,40.44 | U$7.P$38 11.8,37.33 16.01,37.33
  Top 0.305: 16.01,37.33 20.12,41.3 28.82,41.3 28.99,41.31 v29.85,41.31
  Route15 0.305: v29.85,41.31 34.48,41.42 44.19,41.42 45.36,41.43 58.91,41.43 59.47,41.14 v59.47,40.44
  Bottom 0.254: v42.53,41.51 42.44,58.03 | 42.93,58.47 42.99,58.53 U$1.P1.6_GPIO/PWM
  Bottom 0.305: 42.44,58.03 42.93,58.47
  other vias: 59.47,39.61 41.91,41.47 29.25,41.31
SCL  (via drill 0.3)  (1 unrouted)
  Top 0.305: U$4.4 v48.74,51.35 v49.16,51.83 48.84,51.35 50.46,53.79 51.64,53.79 R11.2
  Route15 0.254: 51.27,60.01 v51.27,60.63 | v45.3,36.99 43.45,39.03 32.3,39.03 28.64,35.37 25,35.37 22.11,32.48 15.88,32.48 14.8,33.57 U$7.P$33
  Route15 0.305: v49.16,51.83 51.27,53.93 51.27,60.01 v51.27,60.03
  Bottom 0.254: v48.74,51.35 47.7,50.31 47.7,39.38 45.41,37.09 v45.3,36.99
  Bottom 0.305: v51.27,60.03 U$1.P5.1_I2C-SCL-1
  other vias: 44.86,37.46
SDA  (via drill 0.3)  (2 unrouted)
  Top 0.254: U$4.5 v48.21,55.07 48.25,55.07 53.26,55.07 53.75,54.59 R10.2
  Top 0.305: v48.91,55.06 48.84,55.08 48.87,55.08
  Route15 0.254: v50.38,59.77 v49.78,59.77 | 45.46,45.49 46.18,45.32 v46.2,45.3
  Route15 0.305: v48.21,55.07 48.24,55.03 | 45.46,45.49 29.03,45.49 24.88,41.22 20.8,41.22 17.27,37.69 15.62,37.69 14.04,36.11 U$7.P$37 | v48.91,55.06 50.38,55.06 v50.38,59.77
  Bottom 0.254: U$1.P5.0_I2C-SDA-1 51.94,59.52 51.59,59.17 50.98,59.17 v50.38,59.77 | v46.2,45.3 46.2,50.13 48.17,52.1 48.17,55.03 v48.21,55.07
  other vias: 46.78,45.3
SYNC1  (via drill 0.3)  (1 unrouted)
  Route15 0.254: U$7.P$45 14.65,42.72 23.93,42.72 28.21,47 40.66,47 | 40.66,47 40.63,46.97 40.57,46.97 | 40.66,47 49.19,47 49.8,47.61 59.62,47.61 60.2,48.2 v60.2,51.37
  Bottom 0.254: v60.2,51.37 60.2,53.67 U$1.P7.2_SYNC1
  other vias: 60.2,51.97
SYNC2  (via drill 0.3)
  Route15 0.254: U$7.P$49 18.2,43.73 22.02,47.54 48.84,47.54 49.49,48.18 58.92,48.18 59.37,48.63 v59.37,49.49
  Bottom 0.254: v59.37,49.49 60.58,49.49 60.85,49.76 60.85,52.52 60.7,52.67 60.7,53.67 U$1.PJ.3_SYNC2
TOVER  (via drill 0.3)  (4 unrouted)
  Top 0.254: R4.1 57.6,8.82 v57.32,9.1 v57.92,9.1
  Route15 0.254: v61.74,49.62 61.74,59.01 v61.71,59.04
  Bottom 0.254: v57.92,9.1 61.95,9.1 62.59,9.74 62.59,17.5 63.36,18.27 65.7,18.27 66.16,18.73 66.16,49.51 66.05,49.62 v61.74,49.62 | v61.71,59.04 U$1.P1.7_GPIO/PWM
  other vias: 61.71,58.44 61.74,50.22
TRIP-TEST  (1 unrouted)
  Top 0.254: 65.27,10.66 U$6.5
V-BATT  (via drill 0.3, 2.7)  (3 unrouted)
  Top 0.254: 34.7,58.52 37.6,58.52 37.6,53.19 43.08,53.19 43.95,54.06 43.96,54.07 45.72,54.07 U$4.8
  Top 0.305: 45.71,54.08 U$4.8 | RVD.2 61.42,41.22 | 43.95,54.06 46.23,56.59 v49.37,56.59 | v50.85,40.06 50.85,40.04 50.89,40.07 50.95,40.07 | 50.95,40.07 R7.2 | 50.95,40.07 50.93,40.06 v49.92,40.06 | v48.66,56.56 48.39,56.58
  Top 0.406: R7.2 53.56,41.22 56.23,41.22 61.42,41.22
  Top 0.61: 26.95,60.43 26.95,50.66 26.92,50.63 | 29.03,58.02 24.6,58.02 24.54,58.08 | 29.18,52.83 24.68,52.83 24.65,52.8 24.6,52.8 24.54,52.74 24.45,52.74 24.45,52.72 24.51,52.66 | 29.18,77.98 24.94,77.98 | 27.03,80.28 27.03,70.73 | 29.35,72.88 24.83,72.88 24.77,72.94 | 34.7,58.52 U$3.P$2
  Bottom 0.813: 26.92,50.7 26.92,80.54 26.83,80.54 26.83,80.39 26.76,80.39 | 24.99,77.96 24.99,77.88 29.24,77.88 | 24.99,72.75 29.24,72.75 | 24.91,57.89 29.16,57.89 | 24.88,52.93 29.13,52.93
  other vias: 24,51 24,56 24,61 20,61 28,61 28,66 24,66 20,66 20,70 24,70 28,70 24,74 24,78 23.7,87 34.5,87
  pour Top: 29.61,49.99 29.61,89.66 16.69,89.66 16.69,49.58 29.57,49.58 29.57,49.77
  pour Top: 37.89,57.53 37.99,89.96 30.89,89.95 30.89,57.54 37.34,57.54
  pour Bottom (isolate 0.254): 29.61,49.99 29.61,89.06 16.69,89.06 16.69,49.58 29.57,49.58 29.57,49.77
VOLTAGE-ADC  (via drill 0.3)  (3 unrouted)
  Top 0.254: v48.95,45.56 48.95,45.53 48.98,45.5 48.96,45.5 48.96,45.52 | U$7.P$42 11.82,39.89 16.1,39.89 16.11,39.89
  Top 0.305: R1.1 55.06,45.51 R2.2 52.41,45.49 C5.1 49.59,45.59 v49.55,45.56 49.04,45.56 48.98,45.5 | 16.11,39.89 18.18,42.16 v28.28,42.16
  Route15 0.254: v28.28,42.16 29.3,43.18 47.33,43.18 47.77,43.63 47.77,44.91 48.33,45.53 | v49.55,45.56 49.55,46.46 50.13,47.04 62.35,47.04 62.64,47.73 62.64,60.06 v62.63,60.11
  Route15 0.305: 48.33,45.53 v48.95,45.56
  Bottom 0.254: v62.63,60.11 62.67,62.04 63.02,62.51 64.05,62.51 U$1.P1.1_A1
  other vias: 62.03,60.11 27.68,42.16
VTEMP  (via drill 0.3)  (3 unrouted)
  Top 0.254: U$6.8 v68.63,10.68 | v68.63,10.68 | v67.99,10.69 68,10.69 | 68,10.69 v68.01,10.68 | 68,10.69 68.62,10.69 arc-90 v68.63,10.68
  Route15 0.254: U$7.P$35 9.31,32.29 11.26,32.29 11.81,32.85 11.81,34.21 12.42,34.82 14.75,34.82 16.53,33.04 21.57,33.04 24.61,36.08 24.61,38.04 26.14,39.57 32.66,39.57 35.61,39.64 43.9,39.64 47.73,35.5 47.73,20.08 48.45,19.36 50.16,19.36 50.84,18.67 50.84,11.75 52.01,10.59 67.92,10.59 arc90 v68.01,10.68 | v66.15,63.03 v66.16,63.03 68.27,63.03 68.63,62.57 68.63,55.3 v68.57,55.15
  Bottom 0.254: v68.63,10.68 68.63,55.5 v68.57,55.15 | 64.07,63.04 U$1.P1.0_A0 | v66.15,63.03 U$1.P1.0_A0 | U$1.P1.0_A0
  other vias: 68.57,54.55 65.55,63.03

### Text on the board
tSilk: HuskySat | Battery Board | V4 | IN-OUT | IN-OUT | ALCC | SDA | LDO | TPS709 | SCL | ADC | out | CB-EN | LDO-EN | TRIP-TEST | HEAT | GND
_tsilk: V-TEMP | T-under